# EAGLE design Kart_1 (EAGLE 9.6.2)
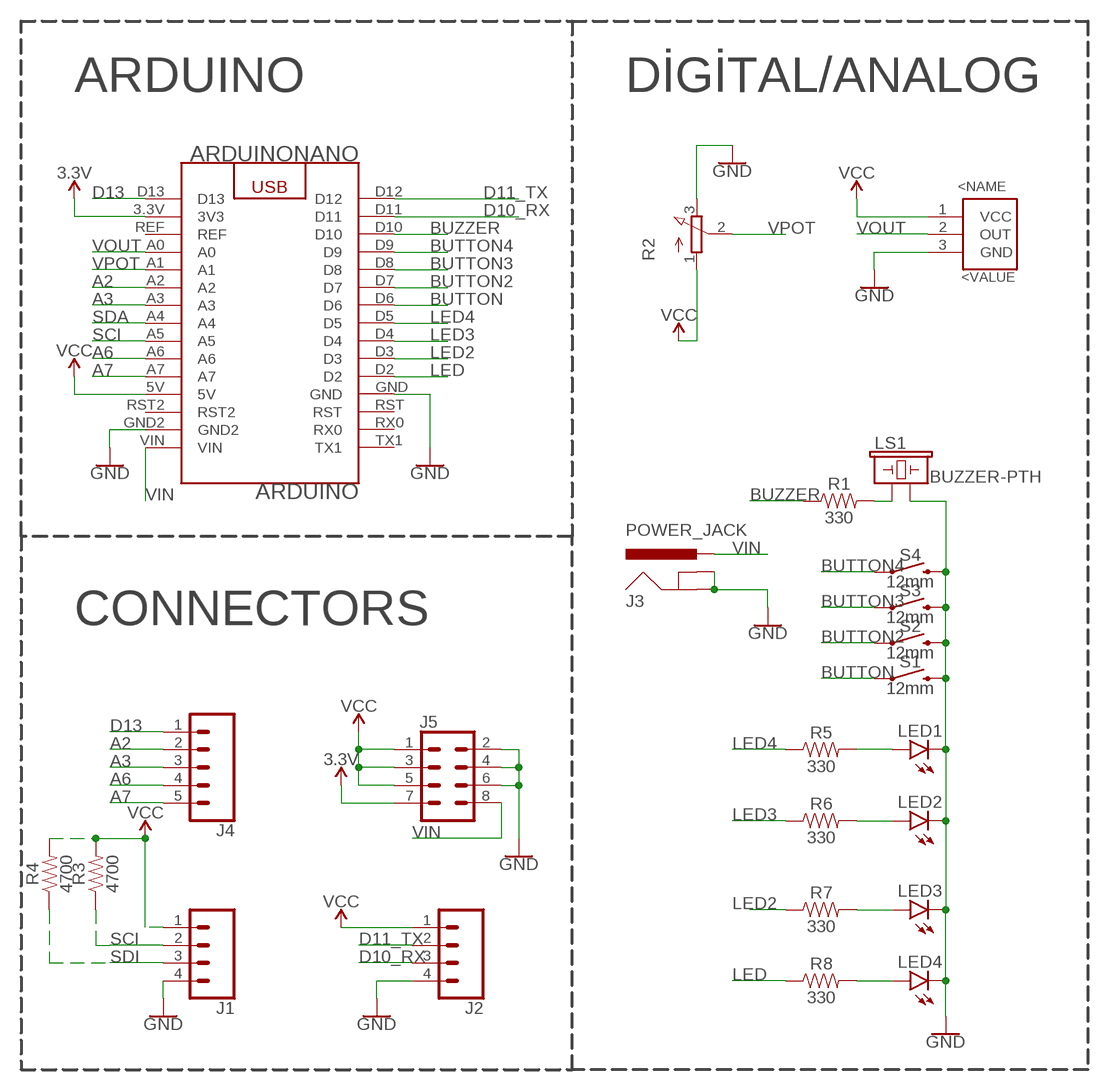
[diagram p0: schematic, sheet 1]

## Parts
ARDUINO  ARDUINONANO  [ARDUINONANO]
J1  CONN_04  [1X04]
J2  CONN_04  [1X04]
J3  POWER_JACK  [POWER_JACK_PTH]
J4  CONN_05  [1X05]
J5  CONN_04X2  [2X4]
LED1  LED3MM  [LED3MM]
LED2  LED3MM  [LED3MM]
LED3  LED3MM  [LED3MM]
LED4  LED3MM  [LED3MM]
LM35  LM35  [TO-92]
LS1  BUZZER-PTH  [BUZZER-12MM]
R1  330  10MOHM-HORIZ-1/4W-5%  [AXIAL-0.3]
R2  3RP/1610N  [3RP/1610N]
R3  4700  10MOHM-HORIZ-1/4W-5%  [AXIAL-0.3]
R4  4700  10MOHM-HORIZ-1/4W-5%  [AXIAL-0.3]
R5  330  10MOHM-HORIZ-1/4W-5%  [AXIAL-0.3]
R6  330  10MOHM-HORIZ-1/4W-5%  [AXIAL-0.3]
R7  330  10MOHM-HORIZ-1/4W-5%  [AXIAL-0.3]
R8  330  10MOHM-HORIZ-1/4W-5%  [AXIAL-0.3]
S1  12mm  MOMENTARY-SWITCH-SPST-PTH-12MM  [TACTILE_SWITCH_PTH_12MM]
S2  12mm  MOMENTARY-SWITCH-SPST-PTH-12MM  [TACTILE_SWITCH_PTH_12MM]
S3  12mm  MOMENTARY-SWITCH-SPST-PTH-12MM  [TACTILE_SWITCH_PTH_12MM]
S4  12mm  MOMENTARY-SWITCH-SPST-PTH-12MM  [TACTILE_SWITCH_PTH_12MM]

## Nets
3.3V: ARDUINO.3.3V(3V3) J5.7
A2: ARDUINO.A2 J4.2
A3: ARDUINO.A3 J4.3
A6: ARDUINO.A6 J4.4
A7: ARDUINO.A7 J4.5
BUTTON: ARDUINO.D6 S1.1
BUTTON2: ARDUINO.D7 S2.1
BUTTON3: ARDUINO.D8 S3.1
BUTTON4: ARDUINO.D9 S4.1
BUZZER: ARDUINO.D10 R1.P$1
D10_RX: ARDUINO.D11 J2.3
D11_TX: ARDUINO.D12 J2.2
D13: ARDUINO.D13 J4.1
GND: ARDUINO.GND ARDUINO.GND2 J1.4 J2.4 J3.GND J3.GNDBREAK J5.2 J5.4 J5.6 LED1.K(C) LED2.K(C) LED3.K(C) LED4.K(C) LM35.3(GND) LS1.- R2.3(E) S1.3 S2.3 S3.3 S4.3
LED: ARDUINO.D2 R8.P$1
LED2: ARDUINO.D3 R7.P$1
LED3: ARDUINO.D4 R6.P$1
LED4: ARDUINO.D5 R5.P$1
N$1: LS1.+ R1.P$2
N$5: LED1.A R5.P$2
N$6: LED2.A R6.P$2
N$7: LED3.A R7.P$2
N$8: LED4.A R8.P$2
SCI: ARDUINO.A5 J1.2 R3.P$1
SDA: ARDUINO.A4
SDI: J1.3 R4.P$1
VCC: ARDUINO.5V J1.1 J2.1 J5.1 J5.3 J5.5 LM35.1(VCC) R2.1(A) R3.P$2 R4.P$2
VIN: ARDUINO.VIN J3.PWR J5.8
VOUT: ARDUINO.A0 LM35.2(OUT)
VPOT: ARDUINO.A1 R2.2(S)
Unconnected: ARDUINO.REF ARDUINO.RST ARDUINO.RST2 ARDUINO.RX0 ARDUINO.TX1

## Notes on the sheet
- ARDUINO | DİGİTAL/ANALOG
- CONNECTORS

## Library data of the parts
ARDUINO = Arduino Paketi:ARDUINONANO: Arduino Nano Device
J1 J2 = SparkFun-Connectors:CONN_04: Multi connection point. Often used as Generic Header-pin footprint for 0.1 inch spaced/style header connections On any of the 0.1 inch spaced packages, you can populate with these: Break Away Headers - Straight <https://www.sparkfun.com/products/116> (PRT-00116) Break Away Male Headers - Right Angle <https://www.sparkfun.com/products/553> (PRT-00553) Female Headers <https://www.sparkfun.com/products/115> (PRT-00115) Break Away Headers - Machine Pin <https://www.sparkfun.com/products/117> (PRT-00117) Break Away Female Headers - Swiss Machine Pin <https://www.sparkfun.com/products/743> (PRT-00743) For SCREWTERMINALS and SPRING TERMINALS visit here: Screw Terimnals on SparkFun.com <https://www.sparkfun.com/search/results?term=Screw+Terminals> (5mm/3.5mm/2.54mm spacing) This device is also useful as a general connection point to wire up your design to another part of your project. Our various solder wires solder well into these plated through hole pads. Hook-Up Wire - Assortment (Stranded, 22 AWG) <https://www.sparkfun.com/products/11375> (PRT-11375) Hook-Up Wire - Assortment (Solid Core, 22 AWG) <https://www.sparkfun.com/products/11367> (PRT-11367) View the entire wire category on our website here <https://www.sparkfun.com/categories/141> Special notes: Molex polarized connector foot print use with SKU : PRT-08231 with associated crimp pins and housings. 1MM SMD Version SKU: PRT-10208; PROD_ID: CONN-09696
J3 = SparkFun-Connectors:POWER_JACK: Power Jack Connector This is the standard 5.5mm barrel jack for power. The PTH is the most common, proven, reliable, footprint. The Slot footprint only works if the mill layer is transmitted to the PCB fab house so be warned. Here are the connectors we sell at SparkFun: DC Barrel Power Jack/Connector <https://www.sparkfun.com/products/119> (PRT-00119) DC Barrel Power Jack/Connector (SMD) <https://www.sparkfun.com/products/12748> (PRT-12748) DC Barrel Jack Adapter - Breadboard Compatible <https://www.sparkfun.com/products/10811> (PRT-10811) It is used on this SparkFun product (and many, many others): SparkFun RedBoard - Programmed with Arduino <https://www.sparkfun.com/products/12757> (DEV-12757) Also, if you need a mating power supply or connector, please check these out: Wall Adapter Power Supply - 9VDC 650mA <https://www.sparkfun.com/products/298> (TOL-00298) DC Barrel Jack Adapter - Male <https://www.sparkfun.com/products/10287> (PRT-10287); PROD_ID: CONN-08197
J4 = SparkFun-Connectors:CONN_05: Multi connection point. Often used as Generic Header-pin footprint for 0.1 inch spaced/style header connections On any of the 0.1 inch spaced packages, you can populate with these: Break Away Headers - Straight <https://www.sparkfun.com/products/116> (PRT-00116) Break Away Male Headers - Right Angle <https://www.sparkfun.com/products/553> (PRT-00553) Female Headers <https://www.sparkfun.com/products/115> (PRT-00115) Break Away Headers - Machine Pin <https://www.sparkfun.com/products/117> (PRT-00117) Break Away Female Headers - Swiss Machine Pin <https://www.sparkfun.com/products/743> (PRT-00743) For SCREWTERMINALS and SPRING TERMINALS visit here: Screw Terimnals on SparkFun.com <https://www.sparkfun.com/search/results?term=Screw+Terminals> (5mm/3.5mm/2.54mm spacing) This device is also useful as a general connection point to wire up your design to another part of your project. Our various solder wires solder well into these plated through hole pads. Hook-Up Wire - Assortment (Stranded, 22 AWG) <https://www.sparkfun.com/products/11375> (PRT-11375) Hook-Up Wire - Assortment (Solid Core, 22 AWG) <https://www.sparkfun.com/products/11367> (PRT-11367) View the entire wire category on our website here <https://www.sparkfun.com/categories/141> Special notes: Molex polarized connector foot print use with SKU : PRT-08231 with associated crimp pins and housings. 1MM SMD Version SKU: PRT-10208
J5 = SparkFun-Connectors:CONN_04X2: Multi connection point. Often used as Generic Header-pin footprint for 0.1 inch spaced/style header connections On any of the 0.1 inch spaced packages, you can populate with these: Break Away Headers - Straight <https://www.sparkfun.com/products/116> (PRT-00116) Break Away Male Headers - Right Angle <https://www.sparkfun.com/products/553> (PRT-00553) Female Headers <https://www.sparkfun.com/products/115> (PRT-00115) Break Away Headers - Machine Pin <https://www.sparkfun.com/products/117> (PRT-00117) Break Away Female Headers - Swiss Machine Pin <https://www.sparkfun.com/products/743> (PRT-00743)
LED1-LED4 = led:LED: LED OSRAM: - CHIPLED LG R971, LG N971, LY N971, LG Q971, LY Q971, LO R971, LY R971 LH N974, LH R974 LS Q976, LO Q976, LY Q976 LO Q996 - Hyper CHIPLED LW Q18S LB Q993, LB Q99A, LB R99A - SideLED LS A670, LO A670, LY A670, LG A670, LP A670 LB A673, LV A673, LT A673, LW A673 LH A674 LY A675 LS A676, LA A676, LO A676, LY A676, LW A676 LS A679, LY A679, LG A679 - Hyper Micro SIDELED® LS Y876, LA Y876, LO Y876, LY Y876 LT Y87S - SmartLED LW L88C, LW L88S LB L89C, LB L89S, LG L890 LS L89K, LO L89K, LY L89K LS L896, LA L896, LO L896, LY L896 - TOPLED LS T670, LO T670, LY T670, LG T670, LP T670 LSG T670, LSP T670, LSY T670, LOP T670, LYG T670 LG T671, LOG T671, LSG T671 LB T673, LV T673, LT T673, LW T673 LH T674 LS T676, LA T676, LO T676, LY T676, LB T676, LH T676, LSB T676, LW T676 LB T67C, LV T67C, LT T67C, LS T67K, LO T67K, LY T67K, LW E67C LS E67B, LA E67B, LO E67B, LY E67B, LB E67C, LV E67C, LT E67C LW T67C LS T679, LY T679, LG T679 LS T770, LO T770, LY T770, LG T770, LP T770 LB T773, LV T773, LT T773, LW T773 LH T774 LS E675, LA E675, LY E675, LS T675 LS T776, LA T776, LO T776, LY T776, LB T776 LHGB T686 LT T68C, LB T68C - Hyper Mini TOPLED® LB M676 - Mini TOPLED Santana® LG M470 LS M47K, LO M47K, LY M47K Source: http://www.osram.convergy.de LUXEON: - LUMILED® LXK2-PW12-R00, LXK2-PW12-S00, LXK2-PW14-U00, LXK2-PW14-V00 LXK2-PM12-R00, LXK2-PM12-S00, LXK2-PM14-U00 LXK2-PE12-Q00, LXK2-PE12-R00, LXK2-PE12-S00, LXK2-PE14-T00, LXK2-PE14-U00 LXK2-PB12-K00, LXK2-PB12-L00, LXK2-PB12-M00, LXK2-PB14-N00, LXK2-PB14-P00, LXK2-PB14-Q00 LXK2-PR12-L00, LXK2-PR12-M00, LXK2-PR14-Q00, LXK2-PR14-R00 LXK2-PD12-Q00, LXK2-PD12-R00, LXK2-PD12-S00 LXK2-PH12-R00, LXK2-PH12-S00 LXK2-PL12-P00, LXK2-PL12-Q00, LXK2-PL12-R00 Source: www.luxeon.com KINGBRIGHT: KA-3528ASYC Source: www.kingbright.com
LM35 = Arduino Paketi:LM35
LS1 = SparkFun-Electromechanical:BUZZER: Buzzer Small round buzzers that operate around the audible 2kHz range. You can use these as speakers to create simple music or user interfaces. Variant Overview: PTH - Mini Speaker - PC Mount 12mm 2.048kHz <https://www.sparkfun.com/products/7950> PTH_KIT - Mini Speaker - PC Mount 12mm 2.048kHz <https://www.sparkfun.com/products/7950> KIT simplifies soldering by adding stop mask to one side of the pads. PTH_NO_SILK - Mini Speaker - PC Mount 12mm 2.048kHz <https://www.sparkfun.com/products/7950> No silkscreen indicator of buzzer outline. PTH_KIT_NO_SILK - Mini Speaker - PC Mount 12mm 2.048kHz <https://www.sparkfun.com/products/7950> KIT package w/o silkscreen SMD - Buzzer Audio Magnetic (CCV-084B16) SMD buzzer used on, e.g. the LilyPad Buzzer <https://www.sparkfun.com/products/8463> and RFID USB Reader <https://www.sparkfun.com/products/9963>. SMD_KIT - Buzzer Audio Magnetic (CCV-084B16) SMD Buzzer with elongated pins to make soldering easier. Used on the SparkFun Simon Says - Surface Mount Soldering Kit <https://www.sparkfun.com/products/10935>.; PROD_ID: COMP-08253; SF_SKU: COM-07950
R1 R3-R8 = SparkFun-Resistors:10MOHM: RES-09327; PROD_ID: RES-09327; VALUE: 10M
R2 = pot:3RP/1610N: 16mm Potentiometer one level Source: http://www.alphapotentiometers.net/html/16mm_pot_2.html
S1-S4 = SparkFun-Switches:MOMENTARY-SWITCH-SPST: Momentary Switch (Pushbutton) - SPST Normally-open (NO) SPST momentary switches (buttons, pushbuttons). Variants PTH-12MM - 12mm square, through-hole Momentary Pushbutton Switch - 12mm Square <https://www.sparkfun.com/products/9190> (COM-09190) PTH-6.0MM, PTH-6.0MM-KIT - 6.0mm square, through-hole Mini Pushbutton Switch <https://www.sparkfun.com/products/97> (COM-00097) KIT package intended for soldering kit's - only one side of pads' copper is exposed. PTH-RIGHT-ANGLE-KIT - Right-angle, through-hole Right Angle Tactile Button <https://www.sparkfun.com/products/10791> - Used on SparkFun BigTime Watch Kit <https://www.sparkfun.com/products/11734> SMD-12MM - 12mm square, surface-mount Tactile Button - SMD (12mm) <https://www.sparkfun.com/products/12993> (COM-12993) Used on SparkFun PicoBoard <https://www.sparkfun.com/products/11888> SMD-4.5MM - 4.5mm Square Trackball Switch Used on SparkFun Blackberry Trackballer Breakout <https://www.sparkfun.com/products/13169> SMD-4.6MMX2.8MM - 4.60mm x 2.80mm, surface mount Used on SparkFun SAMD21 Mini Breakout <https://www.sparkfun.com/products/13664> SMD-5.2MM, SMD-5.2-REDUNDANT - 5.2mm square, surface-mount Mini Pushbutton Switch - SMD <https://www.sparkfun.com/products/8720> (COM-08720) Used on Arduino Pro Mini <https://www.sparkfun.com/products/11114> REDUNDANT package connects both switch circuits together SMD-6.0X3.5MM - 6.0 x 3.5mm, surface mount Momentary Reset Switch SMD <https://www.sparkfun.com/products/8229> (COM-08229) SMD-6.2MM-TALL - 6.2mm square, surface mount Tactile Button - SMD (6mm) <https://www.sparkfun.com/products/12992> Used on SparkFun Digital Sandbox <https://www.sparkfun.com/products/12651> SMD-RIGHT-ANGLE - Right-angle, surface mount Used on SparkFun Block for Intel® Edison - Arduino <https://www.sparkfun.com/products/13036>; PROD_ID: SWCH-09185; SF_SKU: COM-09190

## Board
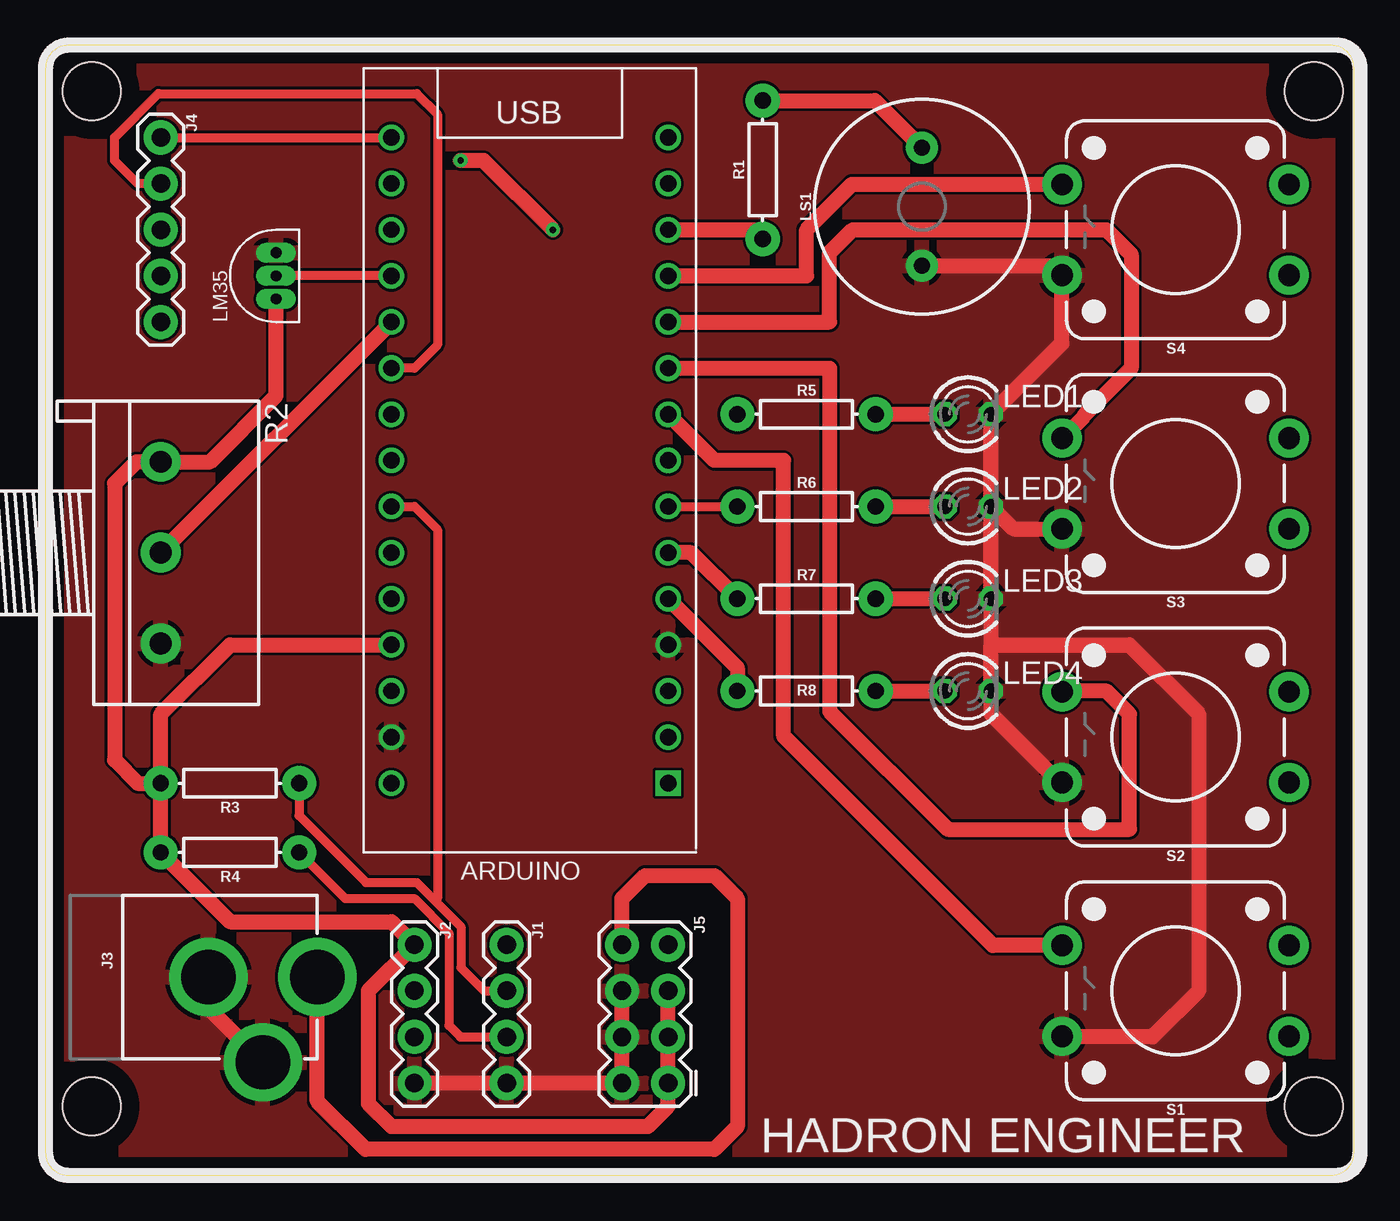
[diagram p1: board, top side]
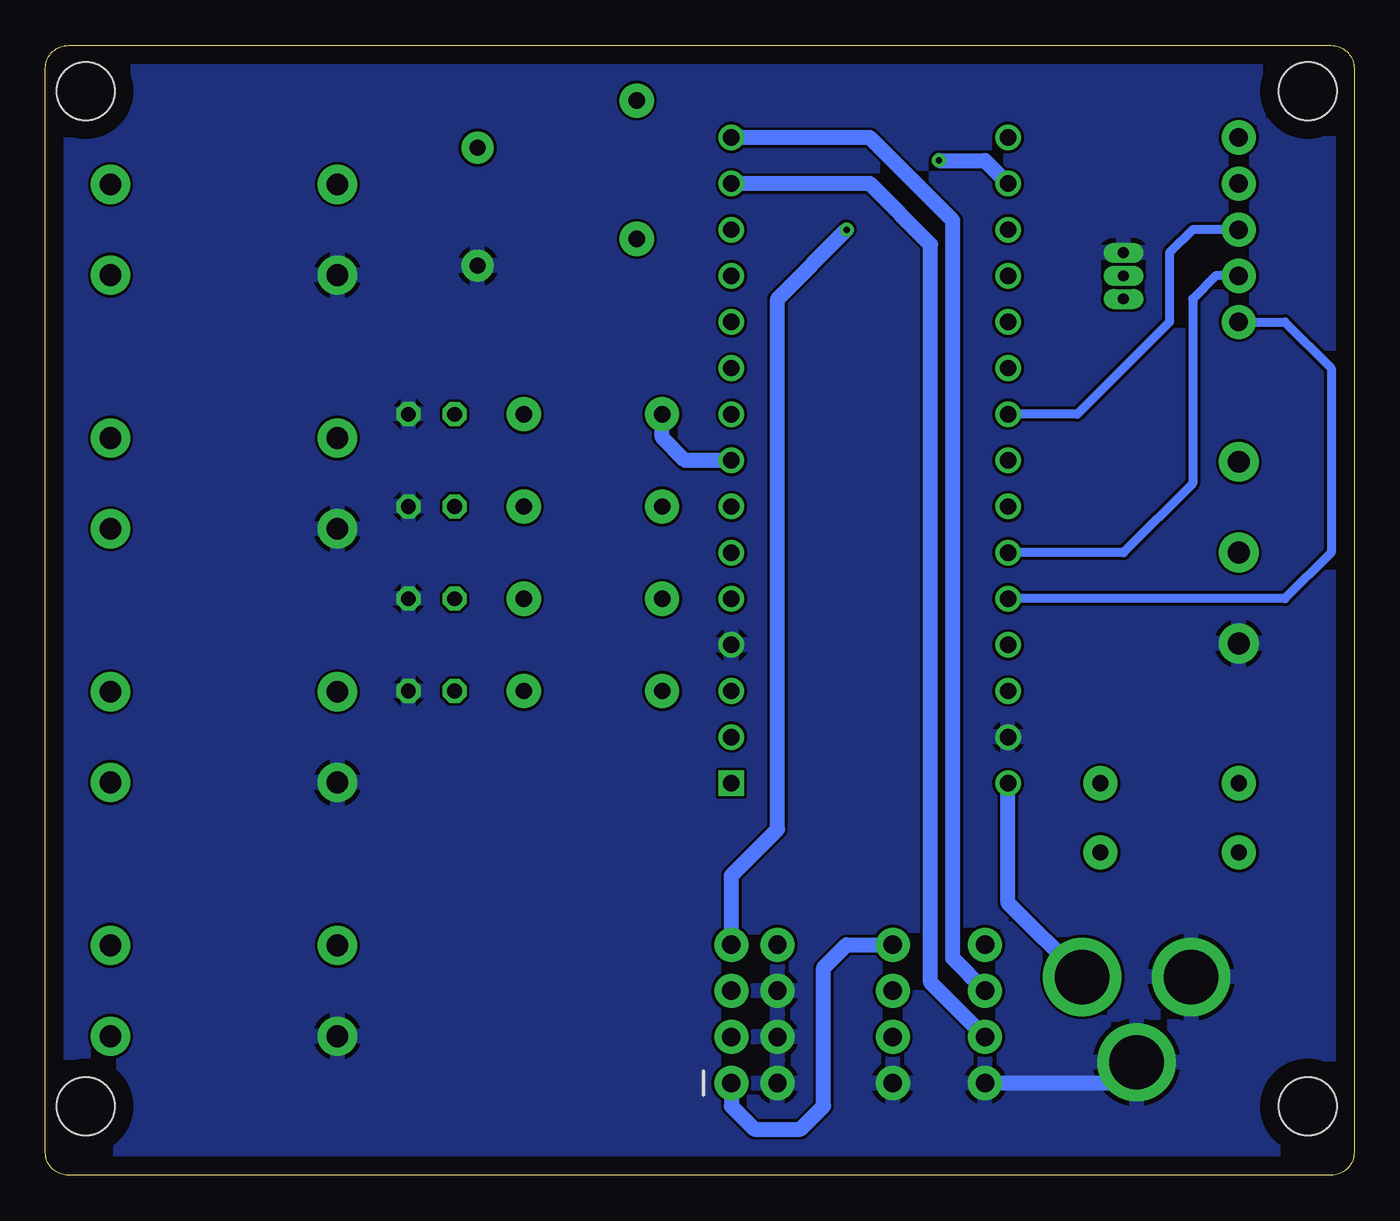
[diagram p2: board, bottom side, seen from below]

Size 72.06 x 62.22 mm. Coordinates in mm from the lower left corner, seen from the top.
Outline: 0,60.95 0,1.27 arc90 1.27,0 70.79,0 arc90 72.06,1.27 72.06,60.95 arc90 70.79,62.22 1.27,62.22 arc90 0,60.95
Copper layers (1*16): Top 0.035mm / dielectric 1.5mm / Bottom 0.035mm
Design rules "default": minimum track width 6mil, minimum drill 0.35mm, track to track 6mil, track to pad 6mil, pad to pad 6mil, via to via 6mil, smd to smd 6mil, copper to edge 40mil, drill to drill 6mil, minimum pad ring 10mil, minimum via ring 8mil, stop-mask expansion 4mil, vias tented up to drill 0mil, thermal gap 10mil
Holes 3.2 mm at 2.54,59.69 2.54,3.81 69.85,3.81 69.85,59.69

### Footprints (pad centres in the part's own frame; a part is rotated, then mirrored left to right if it is on the bottom)
ARDUINONANO = drill 0.9: 3.3V 7.62,-15.24; 5V 7.62,10.16; A0 7.62,-10.16; A1 7.62,-7.62; A2 7.62,-5.08; A3 7.62,-2.54; A4 7.62,0; A5 7.62,2.54; A6 7.62,5.08; A7 7.62,7.62; D2 -7.62,7.62; D3 -7.62,5.08; D4 -7.62,2.54; D5 -7.62,0; D6 -7.62,-2.54; D7 -7.62,-5.08; D8 -7.62,-7.62; D9 -7.62,-10.16; D10 -7.62,-12.7; D11 -7.62,-15.24; D12 -7.62,-17.78; D13 7.62,-17.78; GND -7.62,10.16; GND2 7.62,15.24; REF 7.62,-12.7; RST -7.62,12.7; RST2 7.62,12.7; RX0 -7.62,15.24; VIN 7.62,17.78 | drill 0.9 square: TX1 -7.62,17.78
1X04 = drill 1.016 pad 1.88: 1 0,0; 2 2.54,0; 3 5.08,0; 4 7.62,0
POWER_JACK_PTH = drill 2.997 pad 4.318: GND 0,7.7; GNDBREAK 4.7,10.7; PWR 0,13.7
1X05 = drill 1.016 pad 1.88: 1 0,0; 2 2.54,0; 3 5.08,0; 4 7.62,0; 5 10.16,0
2X4 = drill 1.016 pad 1.88: 1 -3.81,-1.27; 2 -3.81,1.27; 3 -1.27,-1.27; 4 -1.27,1.27; 5 1.27,-1.27; 6 1.27,1.27; 7 3.81,-1.27; 8 3.81,1.27
LED3MM = drill 0.813 octagon: A -1.27,0; K 1.27,0
TO-92 = drill 0.6 long: 1 2.54,1.27; 2 3.81,1.27; 3 5.08,1.27
BUZZER-12MM = drill 0.9 pad 1.778: + 3.25,0; - -3.25,0
AXIAL-0.3 = drill 0.9 pad 1.88: P$1 -3.81,0; P$2 3.81,0
3RP/1610N = drill 1.2 pad 2.184: 1 -5,0; 2 0,0; 3 5,0
TACTILE_SWITCH_PTH_12MM = drill 1.2 pad 2.159: 1 6.25,-2.5; 2 -6.25,-2.5; 3 6.25,2.5; 4 -6.25,2.5

### Placement (x,y rotation side)
ARDUINO  26.67,39.37 180 top
J1  25.4,12.7 270 top
J2  20.32,12.7 270 top
J3  1.27,10.92 270 top
J4  6.35,57.15 270 top
J5  33.02,8.89 90 top
LED1  50.8,41.91 0 top
LED2  50.8,36.83 0 top
LED3  50.8,31.75 0 top
LED4  50.8,26.67 0 top
LM35  13.97,45.72 90 top
LS1  48.26,53.34 90 top
R1  39.5,55.37 90 top
R2  6.35,34.29 270 top
R3  10.16,21.59 180 top
R4  10.16,17.78 180 top
R5  41.91,41.91 0 top
R6  41.91,36.83 0 top
R7  41.91,31.75 0 top
R8  41.91,26.67 0 top
S1  62.23,10.16 180 top
S2  62.23,24.13 180 top
S3  62.23,38.1 180 top
S4  62.23,52.07 180 top

### Tracks (layer width: path | path; a pad name or v marks a point on that pad's centre or on a via)
3.3V  (via drill 0.35)
  Top 0.813: v27.94,52.07 24.13,55.88 v22.86,55.88
  Bottom 0.813: v27.94,52.07 31.75,48.26 31.75,19.05 34.29,16.51 J5.7 | v22.86,55.88 20.32,55.88 ARDUINO.3.3V
A2
  Top 0.508: J4.2 5.08,54.61 3.81,55.88 3.81,57.15 6.22,59.56 20.45,59.56 21.59,58.42 21.59,45.72 20.32,44.45 ARDUINO.A2
A3
  Bottom 0.508: J4.3 8.89,52.07 10.16,50.8 10.16,46.99 15.24,41.91 ARDUINO.A3
A6
  Bottom 0.508: J4.4 7.62,49.53 8.89,48.26 8.89,38.1 12.7,34.29 ARDUINO.A6
A7
  Bottom 0.508: J4.5 3.81,46.99 1.27,44.45 1.27,34.29 3.81,31.75 ARDUINO.A7
BUTTON
  Top 0.813: S1.1 52.17,12.66 40.64,24.19 40.64,39.37 36.83,39.37 ARDUINO.D6
BUTTON2
  Top 0.813: ARDUINO.D7 43.18,44.45 43.18,25.55 49.69,19.05 59.69,19.05 59.69,25.4 58.42,26.67 55.88,26.67 55.92,26.63 S2.1
BUTTON3
  Top 0.813: S3.1 57.2,41.82 57.2,41.86 59.78,44.45 59.78,50.7 58.42,52.07 44.45,52.07 43.18,50.8 43.18,46.99 ARDUINO.D8
BUTTON4
  Top 0.813: ARDUINO.D9 41.91,49.53 41.91,52.07 44.41,54.57 S4.1
BUZZER
  Top 0.813: ARDUINO.D10 38.99,52.07 R1.P$1
D10_RX
  Bottom 0.813: J2.3 23.32,10.62 23.32,51.26 26.67,54.61 ARDUINO.D11
D11_TX
  Bottom 0.813: J2.2 22.1,11.94 22.1,52.58 26.67,57.15 ARDUINO.D12
D13
  Top 0.508: J4.1 ARDUINO.D13
GND
  Top 0.813: J5.6 J5.4 J5.2 J1.4 J2.4 | 52.07,29.21 LED4.K 52.07,25.4 55.88,21.59 | 52.07,29.21 LED3.K LED2.K | LED2.K LED1.K 55.98,45.82 55.98,49.53 | LED2.K 53.3,35.6 S3.3 | 55.98,49.53 S4.3 | LS1.- 55.42,50.09 55.98,49.53 | J3.GNDBREAK 8.97,9.22 J3.GND | 52.07,29.21 59.69,29.21 63.5,25.4 63.5,10.16 60.96,7.62 56.02,7.62 S1.3
  Bottom 0.813: J3.GNDBREAK 13.11,5.08 J2.4
  pour Top: -1.27,64.77 74.93,64.77 74.93,-1.27 -2.54,-1.27 -2.54,64.77
  pour Bottom: -5.08,67.31 -5.08,-2.54 77.47,-2.54 77.47,67.31
LED
  Top 0.813: ARDUINO.D2 38.1,27.94 R8.P$1
LED2
  Top 0.813: R7.P$1 35.56,34.29 ARDUINO.D3
LED3
  Top 0.508: ARDUINO.D4 R6.P$1
LED4
  Bottom 0.813: ARDUINO.D5 36.83,39.37 38.1,40.64 R5.P$1
N$1
  Top 0.813: R1.P$2 45.67,59.18 LS1.+
N$5
  Top 0.813: R5.P$2 LED1.A
N$6
  Top 0.813: R6.P$2 LED2.A
N$7
  Top 0.813: R7.P$2 LED3.A
N$8
  Top 0.813: R8.P$2 LED4.A
SCI
  Top 0.508: R3.P$1 13.97,19.81 17.65,16.13 20.45,16.13 21.46,15.11 | 21.46,15.11 22.88,13.69 22.88,11.43 24.16,10.16 J1.2 | ARDUINO.A5 20.32,36.83 21.59,35.56 21.59,15.24 21.46,15.11
SDI
  Top 0.508: R4.P$1 16.51,15.24 20.32,15.24 22.23,13.33 22.23,8.26 22.86,7.62 J1.3
VCC
  Top 0.813: R3.P$2 R4.P$2 10.16,13.97 19.05,13.97 J2.1 17.78,10.16 17.78,3.96 19.05,2.69 33.17,2.69 34.29,3.81 J5.1 J5.3 J5.5 | LM35.1 12.7,42.93 9.06,39.29 R2.1 5,39.29 3.81,38.1 3.81,22.86 5.08,21.59 R3.P$2 | R3.P$2 6.35,25.4 10.16,29.21 ARDUINO.5V
  Bottom 0.813: J5.1 34.29,3.81 33.02,2.54 30.48,2.54 29.21,3.81 29.21,11.43 27.94,12.7 J1.1
VIN
  Top 0.813: J5.8 31.75,15.24 33.02,16.51 36.83,16.51 38.1,15.24 38.1,2.69 36.83,1.42 17.63,1.42 14.97,4.08 J3.PWR
  Bottom 0.813: J3.PWR 19.05,15 ARDUINO.VIN
VOUT
  Top 0.508: ARDUINO.A0 LM35.2
VPOT
  Top 0.813: R2.2 ARDUINO.A1

### Text on the board
tPlace: HADRON ENGINEER